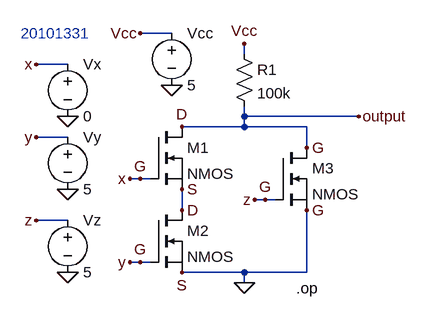
[diagram p0: schematic Logic Function.asc]
Logic Function.asc, the LTspice schematic file:
Version 4
SHEET 1 880 680
WIRE 112 -64 64 -64
WIRE 224 -32 224 -48
WIRE -48 -16 -96 -16
WIRE 224 64 224 48
WIRE 400 64 224 64
WIRE 224 80 224 64
WIRE 224 80 128 80
WIRE 320 80 224 80
WIRE -48 96 -96 96
WIRE 320 112 320 80
WIRE 64 160 48 160
WIRE 80 160 64 160
WIRE 256 192 240 192
WIRE 272 192 256 192
WIRE 128 208 128 176
WIRE -48 224 -96 224
WIRE 64 288 48 288
WIRE 80 288 64 288
WIRE 224 304 128 304
WIRE 320 304 320 208
WIRE 320 304 224 304
WIRE 224 320 224 304
FLAG 112 16 0
FLAG 64 -64 Vcc
FLAG 224 320 0
FLAG -48 64 0
FLAG -48 176 0
FLAG -48 304 0
FLAG -96 -16 x
FLAG -96 96 y
FLAG -96 224 z
FLAG 48 160 x
FLAG 48 288 y
FLAG 240 192 z
FLAG 128 80 D
FLAG 128 176 S
FLAG 64 160 G
FLAG 64 288 G
FLAG 128 208 D
FLAG 128 304 S
FLAG 320 112 G
FLAG 320 208 G
FLAG 256 192 G
FLAG 224 -48 Vcc
FLAG 400 64 output
SYMBOL nmos 80 80 R0
SYMATTR InstName M1
SYMBOL nmos 80 208 R0
SYMATTR InstName M2
SYMBOL nmos 272 112 R0
SYMATTR InstName M3
SYMBOL voltage 112 -80 R0
SYMATTR InstName Vcc
SYMATTR Value 5
SYMBOL voltage -48 -32 R0
SYMATTR InstName Vx
SYMATTR Value 0
SYMBOL voltage -48 80 R0
SYMATTR InstName Vy
SYMATTR Value 5
SYMBOL voltage -48 208 R0
SYMATTR InstName Vz
SYMATTR Value 5
SYMBOL res 208 -48 R0
SYMATTR InstName R1
SYMATTR Value 100k
TEXT 304 328 Left 2 !.op
TEXT -120 -64 Left 2 ;20101331

The netlist it stands for:
* Logic Function.asc
M1 0 0 0 0 NMOS
M2 0 0 0 0 NMOS
M3 0 0 0 0 NMOS
Vcc Vcc 0 5
Vx 0 0 0
Vy 0 0 5
Vz 0 0 5
R1 Vcc 0 100k
.model NMOS NMOS
.model PMOS PMOS
.lib standard.mos
.op
* 20101331
.backanno
.end